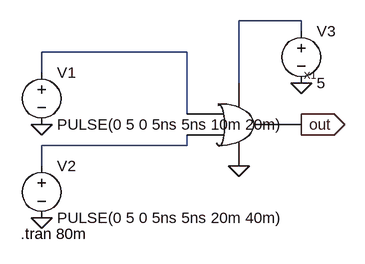
[diagram p0: schematic orgateimplytesting.asc]
orgateimplytesting.asc, the LTspice schematic file:
Version 4
SHEET 1 880 680
WIRE 288 0 192 0
WIRE 288 16 288 0
WIRE 112 48 -112 48
WIRE -112 80 -112 48
WIRE 192 96 192 0
WIRE 112 144 112 48
WIRE 112 192 112 176
WIRE 112 192 -112 192
WIRE -112 224 -112 192
FLAG 288 96 0
FLAG -112 160 0
FLAG -112 304 0
FLAG 192 224 0
FLAG 288 160 out
IOPIN 288 160 Out
SYMBOL voltage -112 64 R0
WINDOW 123 0 0 Left 0
WINDOW 39 0 0 Left 0
SYMATTR InstName V1
SYMATTR Value PULSE(0 5 0 5ns 5ns 10m 20m)
SYMBOL voltage -112 208 R0
WINDOW 123 0 0 Left 0
WINDOW 39 0 0 Left 0
SYMATTR InstName V2
SYMATTR Value PULSE(0 5 0 5ns 5ns 20m 40m)
SYMBOL voltage 288 0 R0
WINDOW 123 0 0 Left 0
WINDOW 39 0 0 Left 0
SYMATTR InstName V3
SYMATTR Value 5
SYMBOL orgateimply 112 176 R0
SYMATTR InstName X1
TEXT -144 328 Left 2 !.tran 80m

The netlist it stands for:
* orgateimplytesting.asc
V1 N002 0 PULSE(0 5 0 5ns 5ns 10m 20m)
V2 N003 0 PULSE(0 5 0 5ns 5ns 20m 40m)
V3 N001 0 5
XX1 N001 N002 N003 0 out orgateimply  ; pins VDD A B VSS OUT
.tran 80m
.backanno
.end